# Altium project Oled_Pro.PrjPcb
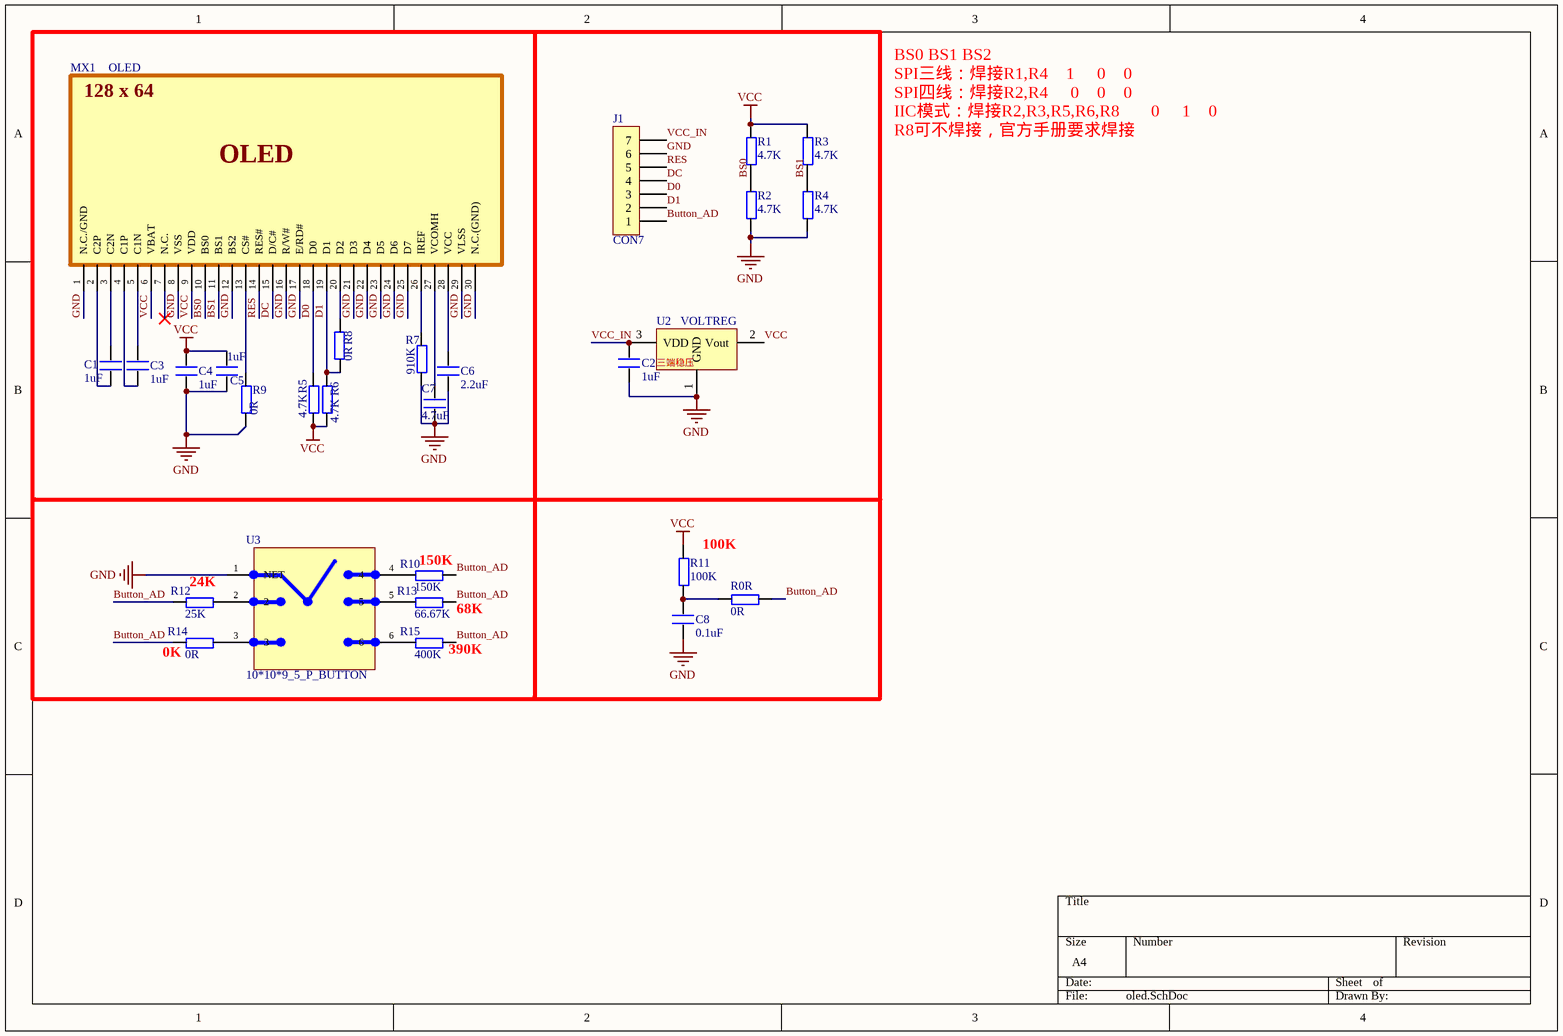
[diagram p0: oled.SchDoc]
1 sheet, 28 parts. Net scope: global (net labels, ports and power ports of the same name join across sheets).
Board file: oled.PcbDoc

## Sheet oled.SchDoc
size A4

### Parts
C1  1uF  [0603P]
C2  1uF  [0603P]
C3  1uF  [0603P]
C4  1uF  [0603P]
C5  1uF  [0603P]
C6  2.2uF  [0603P]
C7  4.7uF  [0603P]
C8  0.1uF  [0603P]
J1  CON7  [GH1.25-卧贴-7-Pin]
MX1  OLED  [OLED]
R0R  0R  [0603P]
R1  4.7K  [0603P]
R2  4.7K  [0603P]
R3  4.7K  [0603P]
R4  4.7K  [0603P]
R5  4.7K  [0603P]
R6  4.7K  [0603P]
R7  910K  [0603P]
R8  0R  [0603P]
R9  0R  [0603P]
R10  150K  [0603P]
R11  100K  [0603P]
R12  25K  [0603P]
R13  66.67K  [0603P]
R14  0R  [0603P]
R15  400K  [0603P]
U2  VOLTREG  [SOT-23-3]
U3  10*10*9_5_P_BUTTON  [10*10*9_5_P_BUTTON]

### Nets
GND: C2.1 C4.1 C5.1 C6.1 C7.1 C8.1 J1.6 MX1.1(N.C./GND) MX1.8(VSS) MX1.12(BS2) MX1.16(R/W#) MX1.17(E/RD#) MX1.21(D3) MX1.22(D4) MX1.23(D5) MX1.24(D6) MX1.25(D7) MX1.29(VLSS) MX1.30(N.C.(GND)) R2.1 R4.1 R7.1 R9.1 U2.1(GND) U3.1(NET)
VCC: C4.2 C5.2 MX1.6(VBAT) MX1.9(VDD) R1.2 R3.2 R5.1 R6.1 R11.2 U2.2(Vout)
BS0: MX1.10(BS0) R1.1 R2.2
BS1: MX1.11(BS1) R3.1 R4.2
Button_AD: J1.1 R0R.2 R10.2 R12.1 R13.2 R14.1 R15.2
D0: J1.3 MX1.18(D0) R5.2
D1: J1.2 MX1.19(D1) R6.2 R8.2
DC: J1.4 MX1.15(D/C#)
RES: J1.5 MX1.14(RES#)
VCC_IN: C2.2 J1.7 U2.3(VDD)
NetC1_1: C1.1 MX1.2(C2P)
NetC1_2: C1.2 MX1.3(C2N)
NetC3_1: C3.1 MX1.4(C1P)
NetC3_2: C3.2 MX1.5(C1N)
NetC6_2: C6.2 MX1.28(VCC)
NetC7_2: C7.2 MX1.27(VCOMH)
NetC8_2: C8.2 R0R.1 R11.1
NetMX1_13: MX1.13(CS#) R9.2
NetMX1_20: MX1.20(D2) R8.1
NetMX1_26: MX1.26(IREF) R7.2
NetR10_1: R10.1 U3.4
NetR12_2: R12.2 U3.2
NetR13_1: R13.1 U3.5
NetR14_2: R14.2 U3.3
NetR15_1: R15.1 U3.6

Not connected (* = marked no-connect by the designer): MX1 7(N.C.)*

### Notes on the sheet
- BS0 BS1 BS2
  SPI三线：焊接R1,R4		  1     0    0
  SPI四线：焊接R2,R4		   0    0    0
  IIC模式：焊接R2,R3,R5,R6,R8   	   0     1    0
  R8可不焊接，官方手册要求焊接
- (near R12) 24K
- (near R10) 150K
- (near R11) 100K
- (near R15) 390K
- (near R13) 68K
- (near R14) 0K
- (in symbol OLED) 128 x 64

### Library data of the parts
C1-C8 = C
J1 = CON7: 连接器
R0R R1-R15 = R
U2 = VOLTREG: 三端稳压